# EAGLE design module_JDY08 (EAGLE 9.4.1)
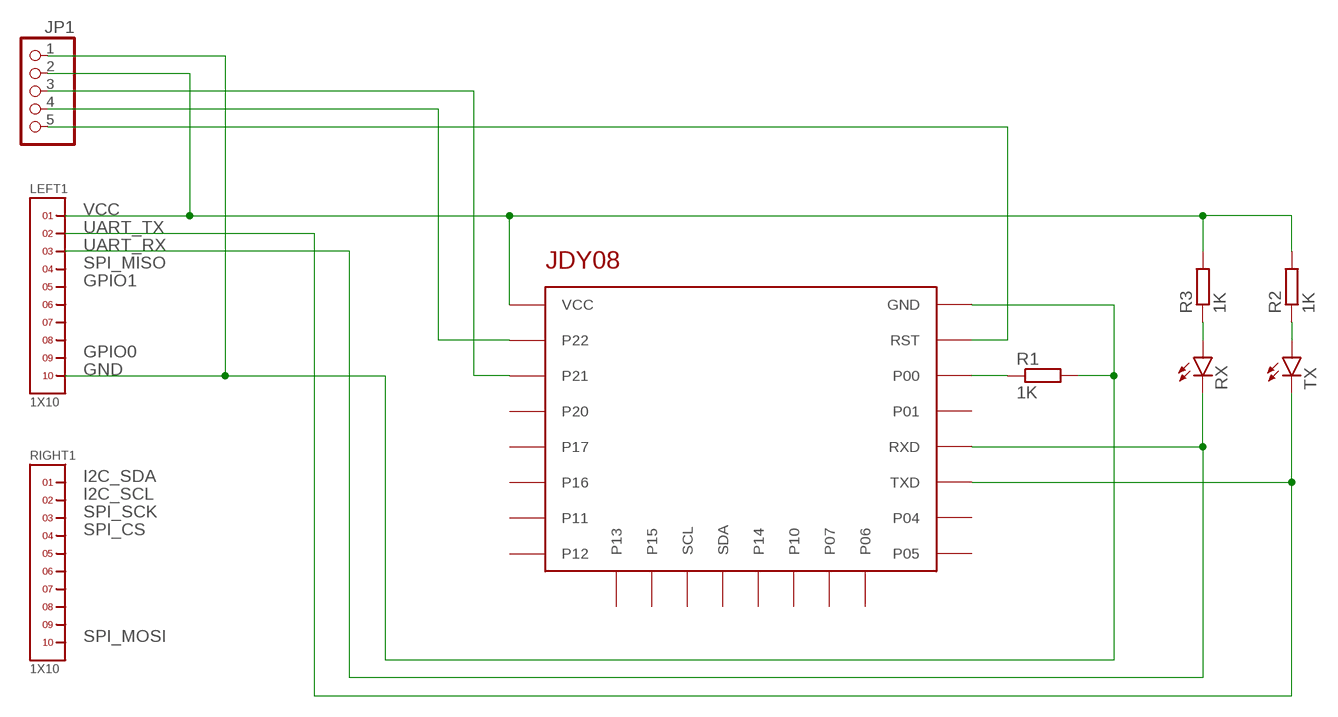
[diagram p0: schematic, sheet 1]

## Parts
JP1  PINHD-1X5  [1X05]
LEFT1  1X10  [1X10]
R1  1K  R-EU_R0603  [R0603]
R2  1K  R-EU_R0603  [R0603]
R3  1K  R-EU_R0603  [R0603]
RIGHT1  1X10  [1X10]
RX  LEDCHIPLED_0603  [CHIPLED_0603]
TX  LEDCHIPLED_0603  [CHIPLED_0603]
U$1  JDY08  [JDY08]

## Nets
GND: JP1.1 LEFT1.10 R1.2 U$1.GND
N$1: JP1.5 U$1.RST
N$2: JP1.3 U$1.P21
N$3: JP1.4 U$1.P22
N$4: LEFT1.3 RX.C U$1.RXD
N$7: R2.1 TX.A
N$8: R3.1 RX.A
N$10: R1.1 U$1.P00
N$11: LEFT1.2 TX.C U$1.TXD
VCC: JP1.2 LEFT1.1 R2.2 R3.2 U$1.VCC
Unconnected: LEFT1.4 LEFT1.5 LEFT1.6 LEFT1.7 LEFT1.8 LEFT1.9 RIGHT1.1 RIGHT1.2 RIGHT1.3 RIGHT1.4 RIGHT1.5 RIGHT1.6 RIGHT1.7 RIGHT1.8 RIGHT1.9 RIGHT1.10 U$1.P01 U$1.P04 U$1.P05 U$1.P06 U$1.P07 U$1.P10 U$1.P11 U$1.P12 U$1.P13 U$1.P14 U$1.P15 U$1.P16 U$1.P17 U$1.P20 U$1.SCL U$1.SDA

## Notes on the sheet
- VCC
- UART_TX
- UART_RX
- SPI_MISO
- GPIO1
- GPIO0
- GND
- I2C_SDA
- I2C_SCL
- SPI_SCK
- SPI_CS
- SPI_MOSI

## Library data of the parts
JP1 = pinhead:PINHD-1X5: PIN HEADER
LEFT1 RIGHT1 = headers(2mm):1X10
R1-R3 = rcl:R-EU_: RESISTOR, European symbol; SPICEPREFIX: R
RX TX = led:LED: LED OSRAM: - CHIPLED LG R971, LG N971, LY N971, LG Q971, LY Q971, LO R971, LY R971 LH N974, LH R974 LS Q976, LO Q976, LY Q976 LO Q996 - Hyper CHIPLED LW Q18S LB Q993, LB Q99A, LB R99A - SideLED LS A670, LO A670, LY A670, LG A670, LP A670 LB A673, LV A673, LT A673, LW A673 LH A674 LY A675 LS A676, LA A676, LO A676, LY A676, LW A676 LS A679, LY A679, LG A679 - Hyper Micro SIDELED® LS Y876, LA Y876, LO Y876, LY Y876 LT Y87S - SmartLED LW L88C, LW L88S LB L89C, LB L89S, LG L890 LS L89K, LO L89K, LY L89K LS L896, LA L896, LO L896, LY L896 - TOPLED LS T670, LO T670, LY T670, LG T670, LP T670 LSG T670, LSP T670, LSY T670, LOP T670, LYG T670 LG T671, LOG T671, LSG T671 LB T673, LV T673, LT T673, LW T673 LH T674 LS T676, LA T676, LO T676, LY T676, LB T676, LH T676, LSB T676, LW T676 LB T67C, LV T67C, LT T67C, LS T67K, LO T67K, LY T67K, LW E67C LS E67B, LA E67B, LO E67B, LY E67B, LB E67C, LV E67C, LT E67C LW T67C LS T679, LY T679, LG T679 LS T770, LO T770, LY T770, LG T770, LP T770 LB T773, LV T773, LT T773, LW T773 LH T774 LS E675, LA E675, LY E675, LS T675 LS T776, LA T776, LO T776, LY T776, LB T776 LHGB T686 LT T68C, LB T68C - Hyper Mini TOPLED® LB M676 - Mini TOPLED Santana® LG M470 LS M47K, LO M47K, LY M47K Source: http://www.osram.convergy.de LUXEON: - LUMILED® LXK2-PW12-R00, LXK2-PW12-S00, LXK2-PW14-U00, LXK2-PW14-V00 LXK2-PM12-R00, LXK2-PM12-S00, LXK2-PM14-U00 LXK2-PE12-Q00, LXK2-PE12-R00, LXK2-PE12-S00, LXK2-PE14-T00, LXK2-PE14-U00 LXK2-PB12-K00, LXK2-PB12-L00, LXK2-PB12-M00, LXK2-PB14-N00, LXK2-PB14-P00, LXK2-PB14-Q00 LXK2-PR12-L00, LXK2-PR12-M00, LXK2-PR14-Q00, LXK2-PR14-R00 LXK2-PD12-Q00, LXK2-PD12-R00, LXK2-PD12-S00 LXK2-PH12-R00, LXK2-PH12-S00 LXK2-PL12-P00, LXK2-PL12-Q00, LXK2-PL12-R00 Source: www.luxeon.com KINGBRIGHT: KA-3528ASYC Source: www.kingbright.com
U$1 = RadioShield:JDY08

## Board
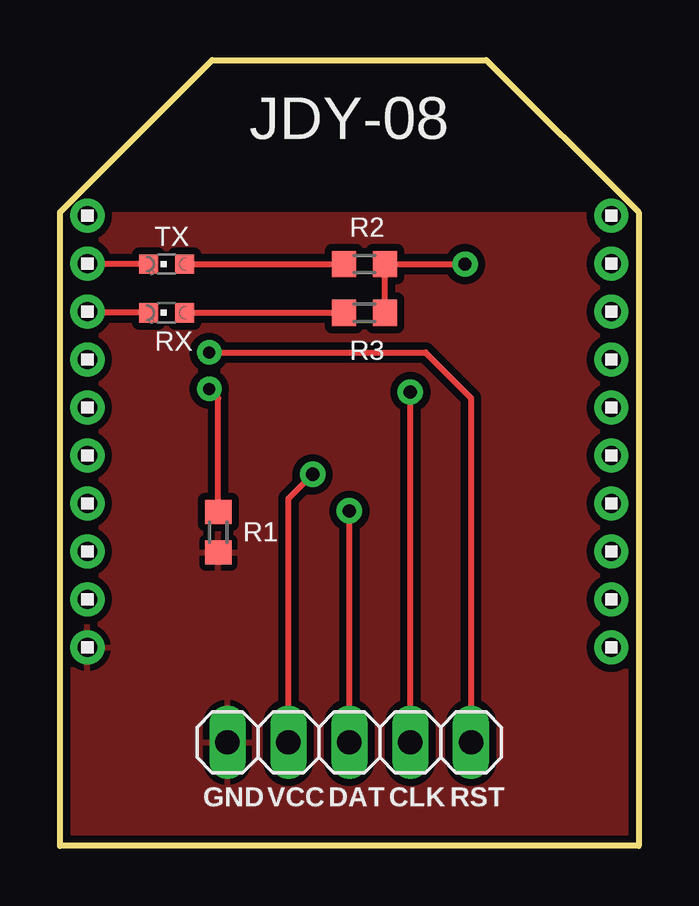
[diagram p1: board, top side]
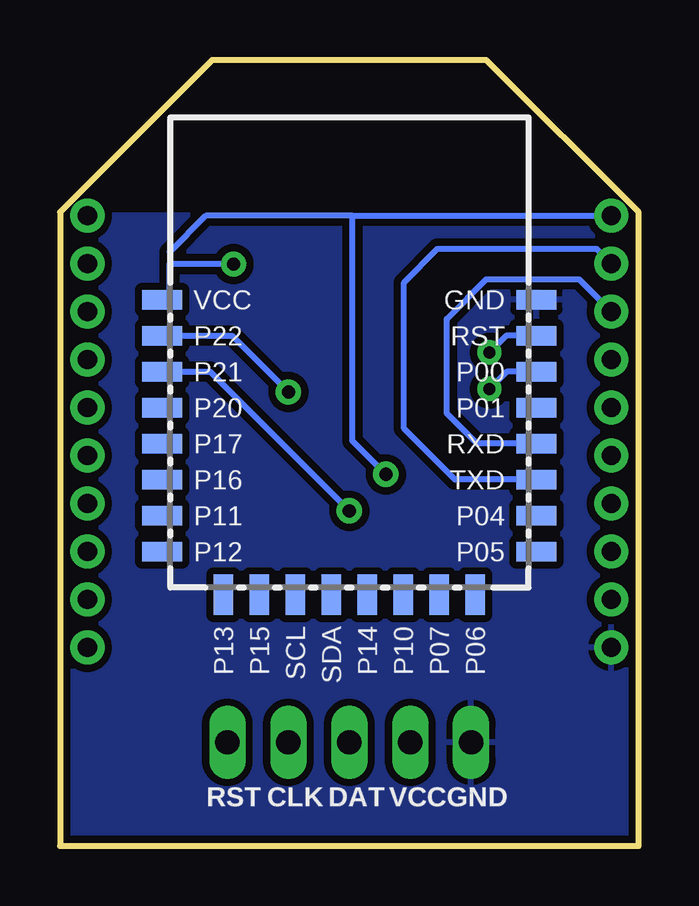
[diagram p2: board, bottom side, seen from below]

Size 24.13 x 32.77 mm. Coordinates in mm from the lower left corner, seen from the top.
Outline: 0,0 0,26.42 6.35,32.77 17.78,32.77 24.13,26.42 24.13,0 0,0
Copper layers (1*16): Top 0.035mm / dielectric 1.5mm / Bottom 0.035mm
Design rules "SparkFun-2-layer-STANDARD": minimum track width 10mil, minimum drill 20mil, track to track 10mil, track to pad 8mil, pad to pad 8mil, via to via 10mil, smd to smd 8mil, copper to edge 8mil, drill to drill 8mil, minimum pad ring 10mil, minimum via ring 10mil, stop-mask expansion 4mil, vias tented up to drill 25mil, thermal gap 10mil

### Footprints (pad centres in the part's own frame; a part is rotated, then mirrored left to right if it is on the bottom)
1X05 = drill 1.016 long: 1 -5.08,0; 2 -2.54,0; 3 0,0; 4 2.54,0; 5 5.08,0
1X10 = drill 0.8 pad 1.422: 1 -9,0; 2 -7,0; 3 -5,0; 4 -3,0; 5 -1,0; 6 1,0; 7 3,0; 8 5,0; 9 7,0; 10 9,0
R0603 = smd 1 x 1.1: 1 -0.85,0; 2 0.85,0
CHIPLED_0603 = smd 0.8 x 0.8: A 0,-0.75; C 0,0.75
JDY08 = smd 1.676 x 0.813: GND 7.8,2.2; P00 7.8,-0.8; P01 7.8,-2.3; P04 7.8,-6.8; P05 7.8,-8.3; P11 -7.8,-6.8; P12 -7.8,-8.3; P16 -7.8,-5.3; P17 -7.8,-3.8; P20 -7.8,-2.3; P21 -7.8,-0.8; P22 -7.8,0.7; RST 7.8,0.7; RXD 7.8,-3.8; TXD 7.8,-5.3; VCC -7.8,2.2 | smd 0.813 x 1.676: P06 5.25,-10.1; P07 3.75,-10.1; P10 2.25,-10.1; P13 -5.25,-10.1; P14 0.75,-10.1; P15 -3.75,-10.1; SCL -2.25,-10.1; SDA -0.75,-10.1

### Placement (x,y rotation side)
JP1  12.06,4.32 0 top
LEFT1  1.14,17.27 270 top
R1  6.6,13.08 270 top
R2  12.7,24.26 0 top
R3  12.7,22.23 0 top
RIGHT1  22.99,17.27 270 top
RX  4.45,22.23 90 top
TX  4.45,24.26 90 top
U$1  12.06,20.57 0 bottom

### Tracks (layer width: path | path; a pad name or v marks a point on that pad's centre or on a via)
GND
  pour Top (isolate 0.305): -0.25,-0.25 24.38,-0.25 24.38,26.29 -0.25,26.29
  pour Bottom (isolate 0.305): -0.51,-0.51 24.64,-0.51 24.64,26.29 -0.51,26.29
N$1  (via drill 0.51)
  Top 0.254: JP1.5 17.14,18.67 15.24,20.57 v6.22,20.57
  Bottom 0.254: U$1.RST 5.52,21.27 v6.22,20.57
N$2  (via drill 0.55)
  Top 0.254: JP1.3 v12.06,13.97
  Bottom 0.254: U$1.P21 17.87,19.77 v12.06,13.97
N$3  (via drill 0.55)
  Top 0.254: JP1.4 v14.6,18.92
  Bottom 0.254: U$1.P22 16.96,21.27 v14.6,18.92
N$4
  Top 0.254: RX.C 1.19,22.23 LEFT1.3
  Bottom 0.254: U$1.RXD 6.74,16.77 8,18.03 8,21.97 6.35,23.62 2.49,23.62 LEFT1.3
N$7
  Top 0.254: TX.A R2.1
N$8
  Top 0.254: RX.A R3.1
N$10  (via drill 0.51)
  Top 0.254: R1.1 6.6,18.67 v6.22,19.05
  Bottom 0.254: U$1.P00 5.5,19.77 v6.22,19.05
N$11
  Top 0.254: TX.C 1.16,24.26 LEFT1.2
  Bottom 0.254: U$1.TXD 7.65,15.27 9.78,17.4 9.78,23.5 8.38,24.89 1.76,24.89 LEFT1.2
VCC  (via drill 0.55)
  Top 0.254: JP1.2 9.52,14.48 v10.54,15.49 | R3.2 R2.2 v16.89,24.26
  Bottom 0.254: 11.94,26.27 18.05,26.27 19.56,24.77 19.56,24.26 | v10.54,15.49 11.94,16.89 11.94,26.27 | v16.89,24.26 19.56,24.26 | U$1.VCC 19.56,23.08 19.56,24.26 | 11.94,26.27 LEFT1.1

### Text on the board
tNames: JDY-08 | GND | VCC | DAT | CLK | RST
bNames: GND | VCC | DAT | CLK | RST
_tNames: R2 | TX | RX | R3 | R1